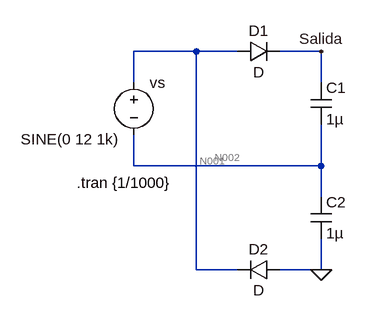
[diagram p0: schematic Punto4.asc]
Punto4.asc, the LTspice schematic file:
Version 4
SHEET 1 880 680
WIRE 32 64 -64 64
WIRE 96 64 32 64
WIRE 224 64 160 64
WIRE -64 112 -64 64
WIRE 224 112 224 64
WIRE -64 240 -64 192
WIRE 224 240 224 176
WIRE 224 240 -64 240
WIRE 224 288 224 240
WIRE 32 400 32 64
WIRE 96 400 32 400
WIRE 224 400 224 352
WIRE 224 400 160 400
FLAG 224 64 Salida
FLAG 224 400 0
SYMBOL voltage -64 96 R0
WINDOW 3 -174 103 Left 2
WINDOW 123 0 0 Left 0
WINDOW 39 0 0 Left 0
SYMATTR InstName vs
SYMATTR Value SINE(0 12 1k)
SYMBOL diode 96 80 R270
WINDOW 0 32 32 VTop 2
WINDOW 3 0 32 VBottom 2
SYMATTR InstName D1
SYMBOL cap 208 112 R0
SYMATTR InstName C1
SYMATTR Value 1µ
SYMBOL cap 208 288 R0
SYMATTR InstName C2
SYMATTR Value 1µ
SYMBOL diode 160 384 R90
WINDOW 0 0 32 VBottom 2
WINDOW 3 32 32 VTop 2
SYMATTR InstName D2
TEXT -152 266 Left 2 !.tran {1/1000}

The netlist it stands for:
* Punto4.asc
vs N001 N002 SINE(0 12 1k)
D1 N001 Salida D
C1 Salida N002 1µ
C2 N002 0 1µ
D2 0 N001 D
.model D D
.lib standard.dio
.tran {1/1000}
.backanno
.end

* Results of the author's LTspice run, read from the files saved beside the schematic
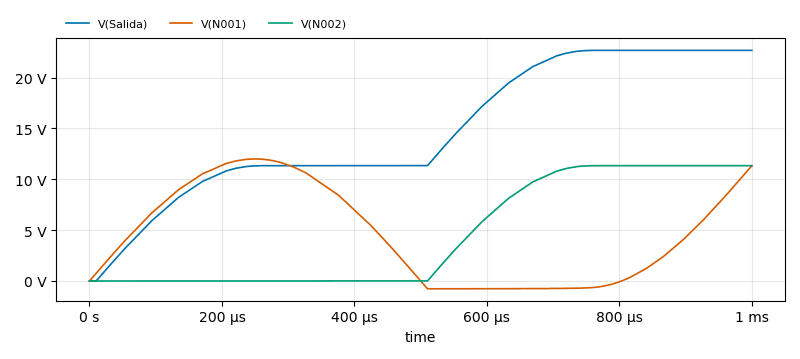
[diagram p1: Transient Analysis of Punto4.asc, plotted from the saved traces]
* Transient Analysis, 1 run:
*   V(Salida): min 0 V, max 22.67 V, average 14.78 V, rms 16.2 V, last 22.67 V
*   V(N001): min -766.9 mV, max 12 V, average 4.549 V, rms 6.569 V, last 11.34 V
*   V(N002): min 0 V, max 11.34 V, average 4.554 V, rms 6.888 V, last 11.34 V